# Altium schematic sheet OLED.SchDoc
size A4
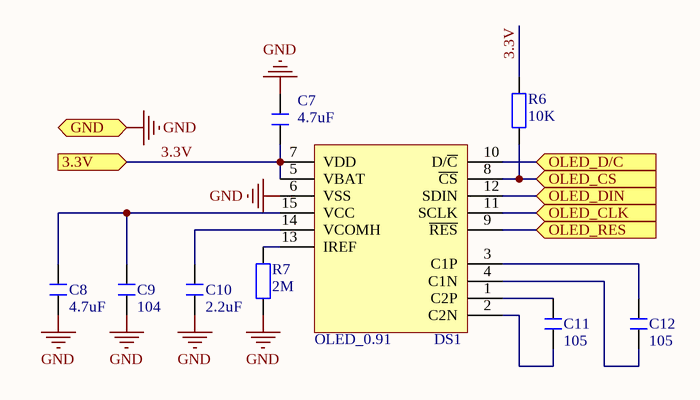
[diagram p0: OLED.SchDoc]

## Parts
C7  4.7uF  [C 0603_L]
C8  4.7uF  [C 0603_L]
C9  104  [C 0603_L]
C10  2.2uF  [C 0603_L]
C11  105  [C 0603_L]
C12  105  [C 0603_L]
DS1  OLED_0.91  [OLED_0.91]
R6  10K  [R 0603_L]
R7  2M  [R 0603_L]

## Ports
3.3V (in), GND, OLED_CLK (in), OLED_CS (in), OLED_D/C (in), OLED_DIN (in), OLED_RES (in)

## Nets
GND: C7.2 C8.1 C9.1 C10.1 DS1.6(VSS) R7.1 ; port GND
3.3V: C7.1 DS1.5(VBAT) DS1.7(VDD) R6.2 ; port 3.3V
OLED_CLK: DS1.11(SCLK) ; port OLED_CLK
OLED_CS: DS1.8(~{CS}) R6.1 ; port OLED_CS
OLED_D/C: DS1.10(D/~{C}) ; port OLED_D/C
OLED_DIN: DS1.12(SDIN) ; port OLED_DIN
OLED_RES: DS1.9(~{RES}) ; port OLED_RES
NetC8_2: C8.2 C9.2 DS1.15(VCC)
NetC10_2: C10.2 DS1.14(VCOMH)
NetC11_1: C11.1 DS1.1(C2P)
NetC11_2: C11.2 DS1.2(C2N)
NetC12_1: C12.1 DS1.3(C1P)
NetC12_2: C12.2 DS1.4(C1N)
NetDS1_13: DS1.13(IREF) R7.2

## Library data of the parts
C7-C12 = C: 贴片电容; BOM名称: 无极性贴片电容; 优秀评价可免费更新: 联系淘宝ID：黄晶宝石，获取更新版封装库; 卖家免费技术支持，联系售后: 唯一出售店铺网址https://shop463601444.taobao.com; 本封装库来自淘宝卖家 ID：黄晶宝石: 其他店铺购入均为盗版，请立即申请退款
R6 R7 = R: 贴片电阻; 优秀评价可免费更新: 联系淘宝ID：黄晶宝石，获取更新版封装库; 卖家免费技术支持，联系售后: 唯一出售店铺网址https://shop463601444.taobao.com; 本封装库来自淘宝卖家 ID：黄晶宝石: 其他店铺购入均为盗版，请立即申请退款; BOM名称: 贴片电阻